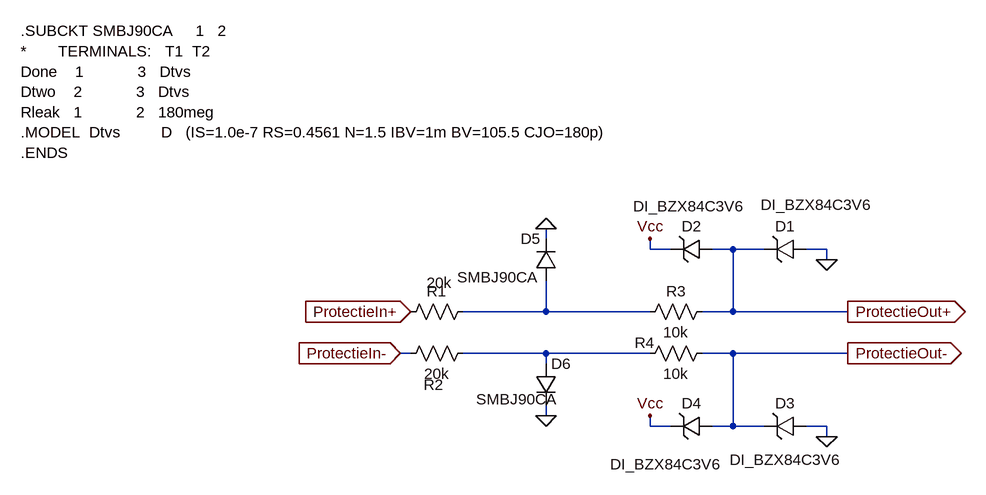
[diagram p0: schematic Protectie.asc]
Protectie.asc, the LTspice schematic file:
Version 4.1
SHEET 1 1180 680
WIRE 64 32 64 16
WIRE 224 48 224 32
WIRE 256 48 224 48
WIRE 352 48 320 48
WIRE 400 48 352 48
WIRE 496 48 464 48
WIRE 496 64 496 48
WIRE 64 144 64 96
WIRE 64 144 -64 144
WIRE 224 144 64 144
WIRE 352 144 352 48
WIRE 352 144 304 144
WIRE 528 144 352 144
WIRE -144 208 -160 208
WIRE 64 208 -64 208
WIRE 224 208 64 208
WIRE 352 208 304 208
WIRE 528 208 352 208
WIRE 64 224 64 208
WIRE 64 304 64 288
WIRE 224 320 224 304
WIRE 256 320 224 320
WIRE 352 320 352 208
WIRE 352 320 320 320
WIRE 400 320 352 320
WIRE 496 320 464 320
WIRE 496 336 496 320
FLAG 496 64 0
FLAG 224 32 Vcc
FLAG 496 336 0
FLAG 224 304 Vcc
FLAG 64 16 0
FLAG 64 304 0
FLAG 528 144 ProtectieOut+
IOPIN 528 144 Out
FLAG 528 208 ProtectieOut-
IOPIN 528 208 Out
FLAG -144 144 ProtectieIn+
IOPIN -144 144 In
FLAG -160 208 ProtectieIn-
IOPIN -160 208 In
SYMBOL res -48 128 R90
WINDOW 0 0 56 VBottom 2
WINDOW 3 -44 52 VTop 2
SYMATTR InstName R1
SYMATTR Value 20k
SYMBOL res -48 192 R90
WINDOW 0 80 61 VBottom 2
WINDOW 3 32 56 VTop 2
SYMATTR InstName R2
SYMATTR Value 20k
SYMBOL res 320 128 R90
WINDOW 0 0 56 VBottom 2
WINDOW 3 32 56 VTop 2
SYMATTR InstName R3
SYMATTR Value 10k
SYMBOL res 320 192 R90
WINDOW 0 15 104 VBottom 2
WINDOW 3 32 56 VTop 2
SYMATTR InstName R4
SYMATTR Value 10k
SYMBOL zener 464 32 R90
WINDOW 0 -4 32 VBottom 2
WINDOW 3 -68 -16 VTop 2
SYMATTR InstName D1
SYMATTR Value DI_BZX84C3V6
SYMATTR Prefix X
SYMBOL zener 320 32 R90
WINDOW 0 -4 32 VBottom 2
WINDOW 3 -66 36 VTop 2
SYMATTR InstName D2
SYMATTR Value DI_BZX84C3V6
SYMATTR Prefix X
SYMBOL zener 464 304 R90
WINDOW 0 -4 32 VBottom 2
WINDOW 3 52 32 VTop 2
SYMATTR InstName D3
SYMATTR Value DI_BZX84C3V6
SYMATTR Prefix X
SYMBOL zener 320 304 R90
WINDOW 0 -4 32 VBottom 2
WINDOW 3 59 72 VTop 2
SYMATTR InstName D4
SYMATTR Value DI_BZX84C3V6
SYMATTR Prefix X
SYMBOL diode 80 96 R180
WINDOW 0 24 64 Left 2
WINDOW 3 29 5 Left 2
SYMATTR InstName D5
SYMATTR Value SMBJ90CA
SYMATTR Prefix X
SYMBOL diode 48 224 R0
WINDOW 3 -91 55 Left 2
SYMATTR Value SMBJ90CA
SYMATTR InstName D6
SYMATTR Prefix X
TEXT -744 -288 Left 2 !.SUBCKT SMBJ90CA     1   2\n*       TERMINALS:   T1  T2\nDone    1            3   Dtvs\nDtwo    2            3   Dtvs\nRleak   1            2   180meg\n.MODEL  Dtvs         D   (IS=1.0e-7 RS=0.4561 N=1.5 IBV=1m BV=105.5 CJO=180p)\n.ENDS

The netlist it stands for:
* Protectie.asc
R1 N001 ProtectieIn+ 20k
R2 N002 ProtectieIn- 20k
R3 ProtectieOut+ N001 10k
R4 ProtectieOut- N002 10k
X§D1 0 ProtectieOut+ DI_BZX84C3V6  ; pins + -
X§D2 ProtectieOut+ Vcc DI_BZX84C3V6  ; pins + -
X§D3 0 ProtectieOut- DI_BZX84C3V6  ; pins + -
X§D4 ProtectieOut- Vcc DI_BZX84C3V6  ; pins + -
X§D5 N001 0 SMBJ90CA  ; pins + -
X§D6 N002 0 SMBJ90CA  ; pins + -
.SUBCKT SMBJ90CA     1   2
*       TERMINALS:   T1  T2
Done    1            3   Dtvs
Dtwo    2            3   Dtvs
Rleak   1            2   180meg
.MODEL  Dtvs         D   (IS=1.0e-7 RS=0.4561 N=1.5 IBV=1m BV=105.5 CJO=180p)
.ENDS
.backanno
.end